# Altium schematic sheet Sheet_1_2023-04-29.schdoc
size 285 x 144 mm
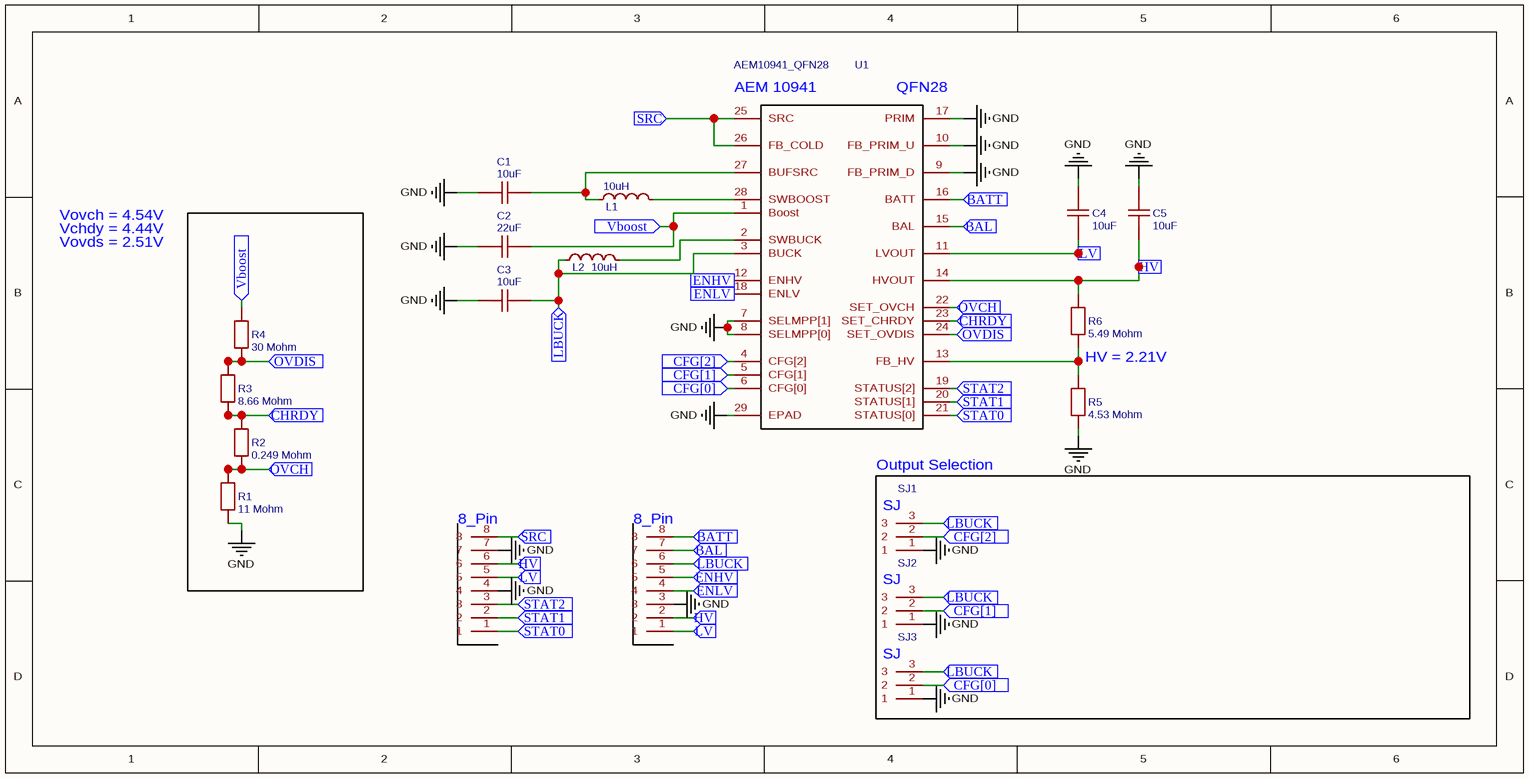
[diagram p0: Sheet_1_2023-04-29.schdoc]

## Parts
C1  10uF  [C0402]
C2  22uF  [C0402]
C3  10uF  [C0402]
C4  10uF  [C0402]
C5  10uF  [C0402]
L1  LPS4012  [LPS4012 COILCRAFT]  (value not drawn)
L2  10uH  [L0603]
R1  11 Mohm  [R0603]
R2  0.249 Mohm  [R0603]
R3  8.66 Mohm  [R0603]
R4  30 Mohm  [R0603]
R5  4.53 Mohm  [R0603]
R6  5.49 Mohm  [R0603]
SJ1  Solder_Jumper  [SOLDER_JUMPER]  (value not drawn)
SJ2  Solder_Jumper  [SOLDER_JUMPER]  (value not drawn)
SJ3  Solder_Jumper  [SOLDER_JUMPER]  (value not drawn)
U1  AEM10941_QFN28  [AEM_QFN28]
U6  8_pin_2.54_header  [8_PIN_HEADER]  (value not drawn)
U7  8_pin_2.54_header  [8_PIN_HEADER]  (value not drawn)

## Blocks framed on the sheet
Output Selection: SJ1-SJ3

## Ports
BAL (in), BATT (in), CFG[0] (in), CFG[1] (in), CFG[2] (in), CHRDY (in), ENHV (in), ENLV (in), HV (in), LBUCK (in), LV (in), OVCH (in), OVDIS (in), SRC (in), STAT0 (in), STAT1 (in), STAT2 (in), Vboost (in)

## Nets
GND: C1.1 C2.1 C3.1 C4.1 C5.1 R1.1 R5.1 SJ1.1 SJ2.1 SJ3.1 U1.7(SELMPP[1]) U1.8(SELMPP[0]) U1.9(FB_PRIM_D) U1.10(FB_PRIM_U) U1.17(PRIM) U1.29(EPAD) U6.3 U7.4 U7.7
BAL: U1.15(BAL) U6.7 ; port BAL
BATT: U1.16(BATT) U6.8 ; port BATT
CFG[0]: SJ3.2 U1.6(CFG[0]) ; port CFG[0]
CFG[1]: SJ2.2 U1.5(CFG[1]) ; port CFG[1]
CFG[2]: SJ1.2 U1.4(CFG[2]) ; port CFG[2]
CHRDY: R2.2 R3.1 U1.23(SET_CHRDY) ; port CHRDY
ENHV: U1.12(ENHV) U6.5 ; port ENHV
ENLV: U1.18(ENLV) U6.4 ; port ENLV
HV: C5.2 R6.2 U1.14(HVOUT) U6.2 U7.6 ; port HV
LBUCK: C3.2 L2.1 SJ1.3 SJ2.3 SJ3.3 U1.3(BUCK) U6.6 ; port LBUCK
LV: C4.2 U1.11(LVOUT) U6.1 U7.5 ; port LV
OVCH: R1.2 R2.1 U1.22(SET_OVCH) ; port OVCH
OVDIS: R3.2 R4.1 U1.24(SET_OVDIS) ; port OVDIS
SRC: U1.25(SRC) U1.26(FB_COLD) U7.8 ; port SRC
STAT0: U1.21(STATUS[0]) U7.1 ; port STAT0
STAT1: U1.20(STATUS[1]) U7.2 ; port STAT1
STAT2: U1.19(STATUS[2]) U7.3 ; port STAT2
Vboost: C2.2 R4.2 U1.1(Boost) ; port Vboost
NetC1_2: C1.2 L1.1 U1.27(BUFSRC)
NetL1_2: L1.2 U1.28(SWBOOST)
NetL2_2: L2.2 U1.2(SWBUCK)
NetR5_2: R5.2 R6.1 U1.13(FB_HV)

## Notes on the sheet
- Vovch = 4.54V
- Vchdy = 4.44V
- Vovds = 2.51V
- HV = 2.21V
- (in symbol 8_pin_2.54_header) 8_Pin
- (in symbol AEM10941_QFN28) AEM 10941; QFN28
- (in symbol LPS4012) 10uH
- (in symbol Solder_Jumper) SJ

## Library data of the parts
C1 C3-C5 = 10uF: nameAlias: Value(F); Contributor: LCEDA_Lib; spicePre: C; spiceSymbolName: C_0402_US
C2 = 22uF: nameAlias: Value(F); Contributor: LCEDA_Lib; spicePre: C; spiceSymbolName: C_0402_US
L1 = LPS4012: BOM_Manufacturer Part: LPS4012-103MRB; Contributor: Bastien Politi; spicePre: L; spiceSymbolName: LPS4012
L2 = 10uH: BOM_Manufacturer Part: MLZ1608M100WT000; BOM_Manufacturer: TDK; nameAlias: Inductance; BOM_Supplier: LCSC; BOM_Supplier Part: C76798; BOM_JLCPCB Part Class: Extended Part; spicePre: L; spiceSymbolName: MLZ1608M100WT000
R1 = 11 Mohm: nameAlias: Value(Ω); Contributor: LCEDA_Lib; spicePre: R; spiceSymbolName: R_0603_EU
R2 = 0.249 Mohm: nameAlias: Value(Ω); Contributor: LCEDA_Lib; spicePre: R; spiceSymbolName: R_0603_EU
R3 = 8.66 Mohm: nameAlias: Value(Ω); Contributor: LCEDA_Lib; spicePre: R; spiceSymbolName: R_0603_EU
R4 = 30 Mohm: nameAlias: Value(Ω); Contributor: LCEDA_Lib; spicePre: R; spiceSymbolName: R_0603_EU
R5 = 4.53 Mohm: nameAlias: Value(Ω); Contributor: LCEDA_Lib; spicePre: R; spiceSymbolName: R_0603_EU
R6 = 5.49 Mohm: nameAlias: Value(Ω); Contributor: LCEDA_Lib; spicePre: R; spiceSymbolName: R_0603_EU
SJ1-SJ3 = Solder_Jumper: Contributor: madub43; spicePre: U; spiceSymbolName: Solder_Jumper
U1 = AEM10941_QFN28: BOM_Manufacturer: e-peas; BOM_Manufacturer Part: 10AEM10941C0000; Contributor: madub43; BOM_Supplier: Mouser; BOM_Supplier Part: 120-AEM10941-QFN; link: https://e-peas.com/product/aem10941/; spicePre: U; spiceSymbolName: AEM10941_QFN28
U6 U7 = 8_pin_2.54_header: Contributor: madub43; spicePre: U; spiceSymbolName: 8_pin_2.54_header